# Altium schematic sheet J4.SchDoc
size A4; CompanyName: Technische Hochschule Nürnberg Georg Simon Ohm; Organization: UltraZohm; Address1: Kesslerplatz 12; Address2: 90489 Nürnberg; Address3: GERMANY; SheetNumber: 6; SheetTotal: 36; Website: www.ultrazohm.com
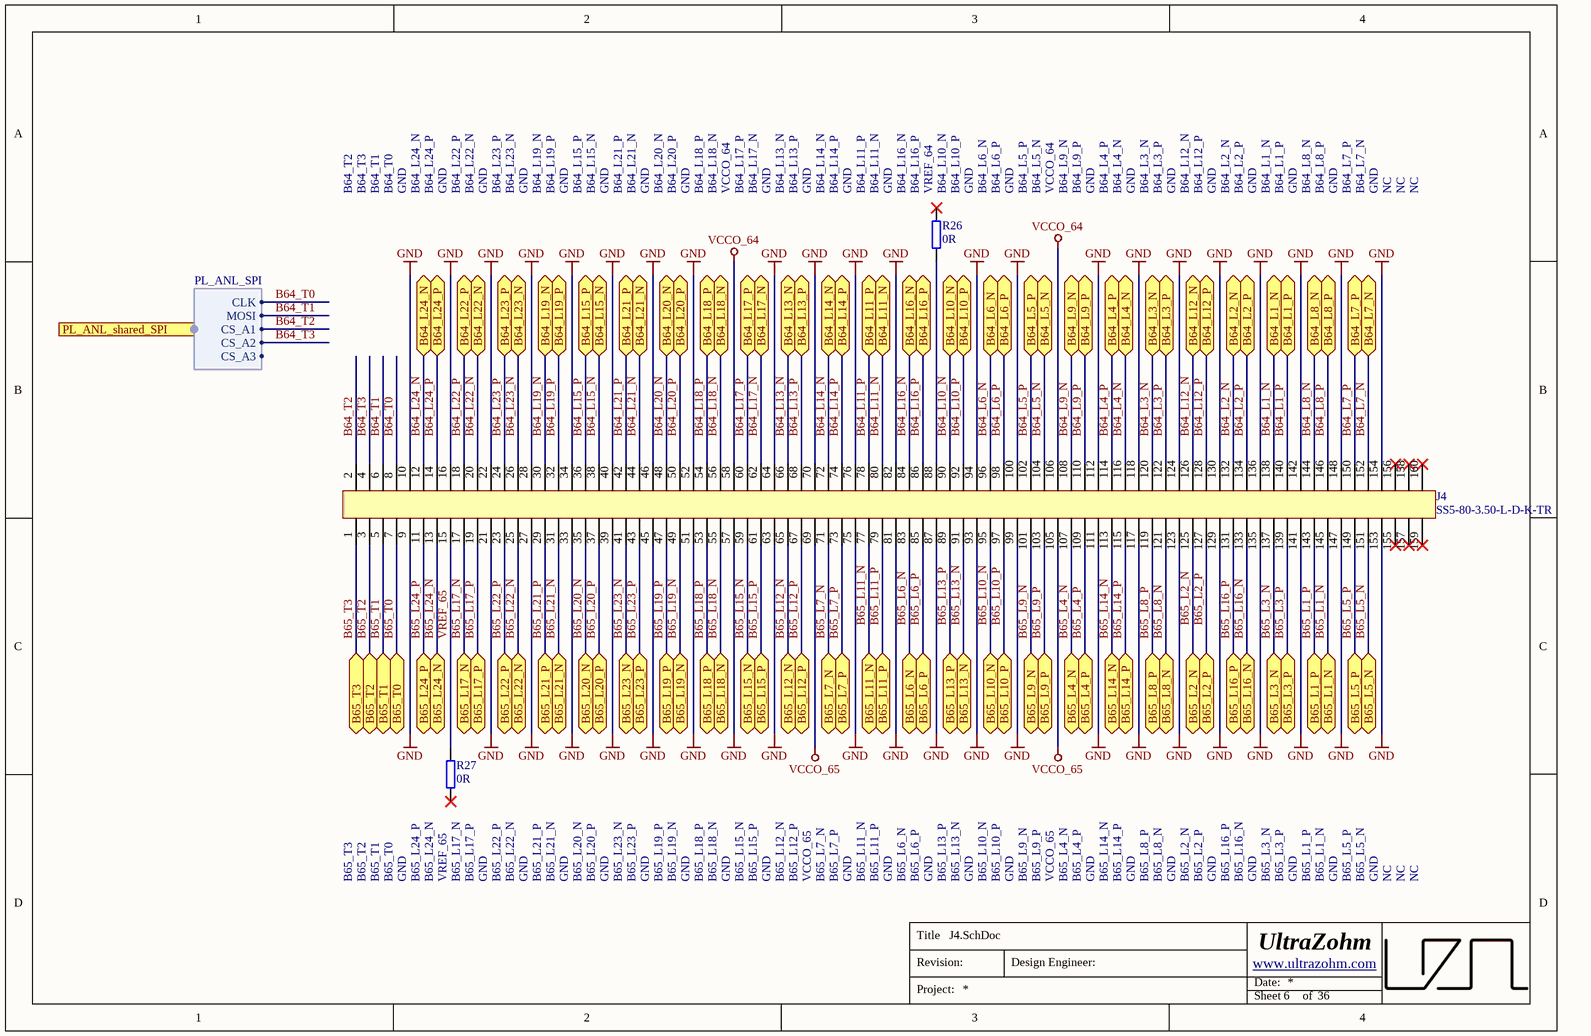
[diagram p0: J4.SchDoc]

## Parts
J4  SS5-80-3.50-L-D-K-TR  [SS5-80-3.50-L-D-K-TR]
R26  0R  [R_0603_TE]
R27  0R  [R_0603_TE]

## Ports
B64_L1_N (bidir), B64_L1_P (bidir), B64_L2_N (bidir), B64_L2_P (bidir), B64_L3_N (bidir), B64_L3_P (bidir), B64_L4_N (bidir), B64_L4_P (bidir), B64_L5_N (bidir), B64_L5_P (bidir), B64_L6_N (bidir), B64_L6_P (bidir), B64_L7_N (bidir), B64_L7_P (bidir), B64_L8_N (bidir), B64_L8_P (bidir), B64_L9_N (bidir), B64_L9_P (bidir), B64_L10_N (bidir), B64_L10_P (bidir), B64_L11_N (bidir), B64_L11_P (bidir), B64_L12_N (bidir), B64_L12_P (bidir), B64_L13_N (bidir), B64_L13_P (bidir), B64_L14_N (bidir), B64_L14_P (bidir), B64_L15_N (bidir), B64_L15_P (bidir), B64_L16_N (bidir), B64_L16_P (bidir), B64_L17_N (bidir), B64_L17_P (bidir), B64_L18_N (bidir), B64_L18_P (bidir), B64_L19_N (bidir), B64_L19_P (bidir), B64_L20_N (bidir), B64_L20_P (bidir), B64_L21_N (bidir), B64_L21_P (bidir), B64_L22_N (bidir), B64_L22_P (bidir), B64_L23_N (bidir), B64_L23_P (bidir), B64_L24_N (bidir), B64_L24_P (bidir), B65_L1_N (bidir), B65_L1_P (bidir), B65_L2_N (bidir), B65_L2_P (bidir), B65_L3_N (bidir), B65_L3_P (bidir), B65_L4_N (bidir), B65_L4_P (bidir), B65_L5_N (bidir), B65_L5_P (bidir), B65_L6_N (bidir), B65_L6_P (bidir), B65_L7_N (bidir), B65_L7_P (bidir), B65_L8_N (bidir), B65_L8_P (bidir), B65_L9_N (bidir), B65_L9_P (bidir), B65_L10_N (bidir), B65_L10_P (bidir), B65_L11_N (bidir), B65_L11_P (bidir), B65_L12_N (bidir), B65_L12_P (bidir), B65_L13_N (bidir), B65_L13_P (bidir), B65_L14_N (bidir), B65_L14_P (bidir), B65_L15_N (bidir), B65_L15_P (bidir), B65_L16_N (bidir), B65_L16_P (bidir), B65_L17_N (bidir), B65_L17_P (bidir), B65_L18_N (bidir), B65_L18_P (bidir), B65_L19_N (bidir), B65_L19_P (bidir), B65_L20_N (bidir), B65_L20_P (bidir), B65_L21_N (bidir), B65_L21_P (bidir), B65_L22_N (bidir), B65_L22_P (bidir), B65_L23_N (bidir), B65_L23_P (bidir), B65_L24_N (bidir), B65_L24_P (bidir), B65_T0 (bidir), B65_T1 (bidir), B65_T2 (bidir), B65_T3 (bidir), PL_ANL_shared_SPI (harness PL_ANL_SPI)

## Harnesses
PL_ANL_SPI: CLK, CS_A1, CS_A2, CS_A3, MOSI

## Nets
GND: J4.9 J4.10 J4.16 J4.21 J4.22 J4.27 J4.28 J4.33 J4.34 J4.39 J4.40 J4.45 J4.46 J4.51 J4.52 J4.57 J4.63 J4.64 J4.70 J4.75 J4.76 J4.81 J4.82 J4.87 J4.93 J4.94 J4.99 J4.100 J4.111 J4.112 J4.117 J4.118 J4.123 J4.124 J4.129 J4.130 J4.135 J4.136 J4.141 J4.142 J4.147 J4.148 J4.153 J4.154
VCCO_64: J4.58 J4.106
VCCO_65: J4.69 J4.105
B64_L1_N: J4.138 ; port B64_L1_N
B64_L1_P: J4.140 ; port B64_L1_P
B64_L2_N: J4.132 ; port B64_L2_N
B64_L2_P: J4.134 ; port B64_L2_P
B64_L3_N: J4.120 ; port B64_L3_N
B64_L3_P: J4.122 ; port B64_L3_P
B64_L4_N: J4.116 ; port B64_L4_N
B64_L4_P: J4.114 ; port B64_L4_P
B64_L5_N: J4.104 ; port B64_L5_N
B64_L5_P: J4.102 ; port B64_L5_P
B64_L6_N: J4.96 ; port B64_L6_N
B64_L6_P: J4.98 ; port B64_L6_P
B64_L7_N: J4.152 ; port B64_L7_N
B64_L7_P: J4.150 ; port B64_L7_P
B64_L8_N: J4.144 ; port B64_L8_N
B64_L8_P: J4.146 ; port B64_L8_P
B64_L9_N: J4.108 ; port B64_L9_N
B64_L9_P: J4.110 ; port B64_L9_P
B64_L10_N: J4.90 ; port B64_L10_N
B64_L10_P: J4.92 ; port B64_L10_P
B64_L11_N: J4.80 ; port B64_L11_N
B64_L11_P: J4.78 ; port B64_L11_P
B64_L12_N: J4.126 ; port B64_L12_N
B64_L12_P: J4.128 ; port B64_L12_P
B64_L13_N: J4.66 ; port B64_L13_N
B64_L13_P: J4.68 ; port B64_L13_P
B64_L14_N: J4.72 ; port B64_L14_N
B64_L14_P: J4.74 ; port B64_L14_P
B64_L15_N: J4.38 ; port B64_L15_N
B64_L15_P: J4.36 ; port B64_L15_P
B64_L16_N: J4.84 ; port B64_L16_N
B64_L16_P: J4.86 ; port B64_L16_P
B64_L17_N: J4.62 ; port B64_L17_N
B64_L17_P: J4.60 ; port B64_L17_P
B64_L18_N: J4.56 ; port B64_L18_N
B64_L18_P: J4.54 ; port B64_L18_P
B64_L19_N: J4.30 ; port B64_L19_N
B64_L19_P: J4.32 ; port B64_L19_P
B64_L20_N: J4.48 ; port B64_L20_N
B64_L20_P: J4.50 ; port B64_L20_P
B64_L21_N: J4.44 ; port B64_L21_N
B64_L21_P: J4.42 ; port B64_L21_P
B64_L22_N: J4.20 ; port B64_L22_N
B64_L22_P: J4.18 ; port B64_L22_P
B64_L23_N: J4.26 ; port B64_L23_N
B64_L23_P: J4.24 ; port B64_L23_P
B64_L24_N: J4.12 ; port B64_L24_N
B64_L24_P: J4.14 ; port B64_L24_P
B64_T0: J4.8 ; port PL_ANL_shared_SPI.CLK
B64_T1: J4.6 ; port PL_ANL_shared_SPI.MOSI
B64_T2: J4.2 ; port PL_ANL_shared_SPI.CS_A1
B64_T3: J4.4 ; port PL_ANL_shared_SPI.CS_A2
B65_L1_N: J4.145 ; port B65_L1_N
B65_L1_P: J4.143 ; port B65_L1_P
B65_L2_N: J4.125 ; port B65_L2_N
B65_L2_P: J4.127 ; port B65_L2_P
B65_L3_N: J4.137 ; port B65_L3_N
B65_L3_P: J4.139 ; port B65_L3_P
B65_L4_N: J4.107 ; port B65_L4_N
B65_L4_P: J4.109 ; port B65_L4_P
B65_L5_N: J4.151 ; port B65_L5_N
B65_L5_P: J4.149 ; port B65_L5_P
B65_L6_N: J4.83 ; port B65_L6_N
B65_L6_P: J4.85 ; port B65_L6_P
B65_L7_N: J4.71 ; port B65_L7_N
B65_L7_P: J4.73 ; port B65_L7_P
B65_L8_N: J4.121 ; port B65_L8_N
B65_L8_P: J4.119 ; port B65_L8_P
B65_L9_N: J4.101 ; port B65_L9_N
B65_L9_P: J4.103 ; port B65_L9_P
B65_L10_N: J4.95 ; port B65_L10_N
B65_L10_P: J4.97 ; port B65_L10_P
B65_L11_N: J4.77 ; port B65_L11_N
B65_L11_P: J4.79 ; port B65_L11_P
B65_L12_N: J4.65 ; port B65_L12_N
B65_L12_P: J4.67 ; port B65_L12_P
B65_L13_N: J4.91 ; port B65_L13_N
B65_L13_P: J4.89 ; port B65_L13_P
B65_L14_N: J4.113 ; port B65_L14_N
B65_L14_P: J4.115 ; port B65_L14_P
B65_L15_N: J4.59 ; port B65_L15_N
B65_L15_P: J4.61 ; port B65_L15_P
B65_L16_N: J4.133 ; port B65_L16_N
B65_L16_P: J4.131 ; port B65_L16_P
B65_L17_N: J4.17 ; port B65_L17_N
B65_L17_P: J4.19 ; port B65_L17_P
B65_L18_N: J4.55 ; port B65_L18_N
B65_L18_P: J4.53 ; port B65_L18_P
B65_L19_N: J4.49 ; port B65_L19_N
B65_L19_P: J4.47 ; port B65_L19_P
B65_L20_N: J4.35 ; port B65_L20_N
B65_L20_P: J4.37 ; port B65_L20_P
B65_L21_N: J4.31 ; port B65_L21_N
B65_L21_P: J4.29 ; port B65_L21_P
B65_L22_N: J4.25 ; port B65_L22_N
B65_L22_P: J4.23 ; port B65_L22_P
B65_L23_N: J4.41 ; port B65_L23_N
B65_L23_P: J4.43 ; port B65_L23_P
B65_L24_N: J4.13 ; port B65_L24_N
B65_L24_P: J4.11 ; port B65_L24_P
B65_T0: J4.7 ; port B65_T0
B65_T1: J4.5 ; port B65_T1
B65_T2: J4.3 ; port B65_T2
B65_T3: J4.1 ; port B65_T3
VREF_65: J4.15 R27.2
NetJ4_88: J4.88 R26.1

Not connected (* = marked no-connect by the designer): J4 155* 156* 157* 158* 159* 160*; R26 2*; R27 1*

## Notes on the sheet
- B64_T2
- B64_T3
- B64_T1
- B64_T0
- GND
- B64_L24_N
- B64_L24_P
- B64_L22_P
- B64_L22_N
- B64_L23_P
- B64_L23_N
- B64_L19_N
- B64_L19_P
- B64_L15_P
- B64_L15_N
- B64_L21_P
- B64_L21_N
- B64_L20_N
- B64_L20_P
- B64_L18_P
- B64_L18_N
- VCCO_64
- B64_L17_P
- B64_L17_N
- B64_L13_N
- B64_L13_P
- B64_L14_N
- B64_L14_P
- B64_L11_P
- B64_L11_N
- (near R26) GND
- (near R26) B64_L16_N
- (near R26) B64_L16_P
- (near R26) VREF_64
- (near R26) B64_L10_N
- (near R26) B64_L10_P
- (near R26) B64_L6_N
- B64_L6_P
- B64_L5_P
- B64_L5_N
- B64_L9_N
- B64_L9_P
- B64_L4_P
- B64_L4_N
- B64_L3_N
- B64_L3_P
- B64_L12_N
- B64_L12_P
- B64_L2_N
- B64_L2_P
- B64_L1_N
- B64_L1_P
- B64_L8_N
- B64_L8_P
- B64_L7_P
- B64_L7_N
- NC
- B65_T3
- B65_T2
- B65_T1
- B65_T0
- (near R27) B65_L24_P
- (near R27) B65_L24_N
- (near R27) VREF_65
- (near R27) B65_L17_N
- (near R27) B65_L17_P
- B65_L22_P
- B65_L22_N
- B65_L21_P
- B65_L21_N
- B65_L20_N
- B65_L20_P
- B65_L23_N
- B65_L23_P
- B65_L19_P
- B65_L19_N
- B65_L18_P
- B65_L18_N
- B65_L15_N
- B65_L15_P
- B65_L12_N
- B65_L12_P
- VCCO_65
- B65_L7_N
- B65_L7_P
- B65_L11_N
- B65_L11_P
- B65_L6_N
- B65_L6_P
- B65_L13_P
- B65_L13_N
- B65_L10_N
- B65_L10_P
- B65_L9_N
- B65_L9_P
- B65_L4_N
- B65_L4_P
- B65_L14_N
- B65_L14_P
- B65_L8_P
- B65_L8_N
- B65_L2_N
- B65_L2_P
- B65_L16_P
- B65_L16_N
- B65_L3_N
- B65_L3_P
- B65_L1_P
- B65_L1_N
- B65_L5_P
- B65_L5_N
- Title
- Revision:
- Design Engineer:
- Date:
- Project:
- Sheet
- of

## Library data of the parts
J4 = SS5-80-3.50-L-D-K-TR: 0.5 mm Ultra Fine Pitch Socket REF192552-01, 160 Pins; Manufacturer: SAMTEC; Created from: MGremer; Number of positions: 80; Manufacturer Part Number: SS5-80-3.50-L-D-K-TR; PartID: 27; Created On: 01/12/2020 18:14:32; ComponentLink1Description: Homepage; ComponentLink1URL: https://www.samtec.com/de/products/ss5-80-3.50-l-d-k-tr; Component Type: Samtec Connector; Device Package: Connector; Last Updated: 11/07/2024 09:43:54; Mounting Type: SMD; Supplier 1: SAMTEC; Supplier Part Number 1: SS5-80-3.50-L-D-K-TR; Type: Connector; Live Cycle Status: 1; Number of rows: 2; Stock number: not stored; LCSC Part Number: C5292077
R26 R27 = UZgen_R_0603_0R: Generic resistor; Manufacturer: UZgen; Tolerance: 1 %; Created from: UZgenTool; Value: 0R; Manufacturer Part Number: UZgen_R_0603_0R; PartID: 581; Created On: 08.07.2024 14:34:30; Device Package: 0603; Mounting Type: SMD; Last Updated: 08.07.2024 14:34:30